# EAGLE design spdif (EAGLE 5.06)
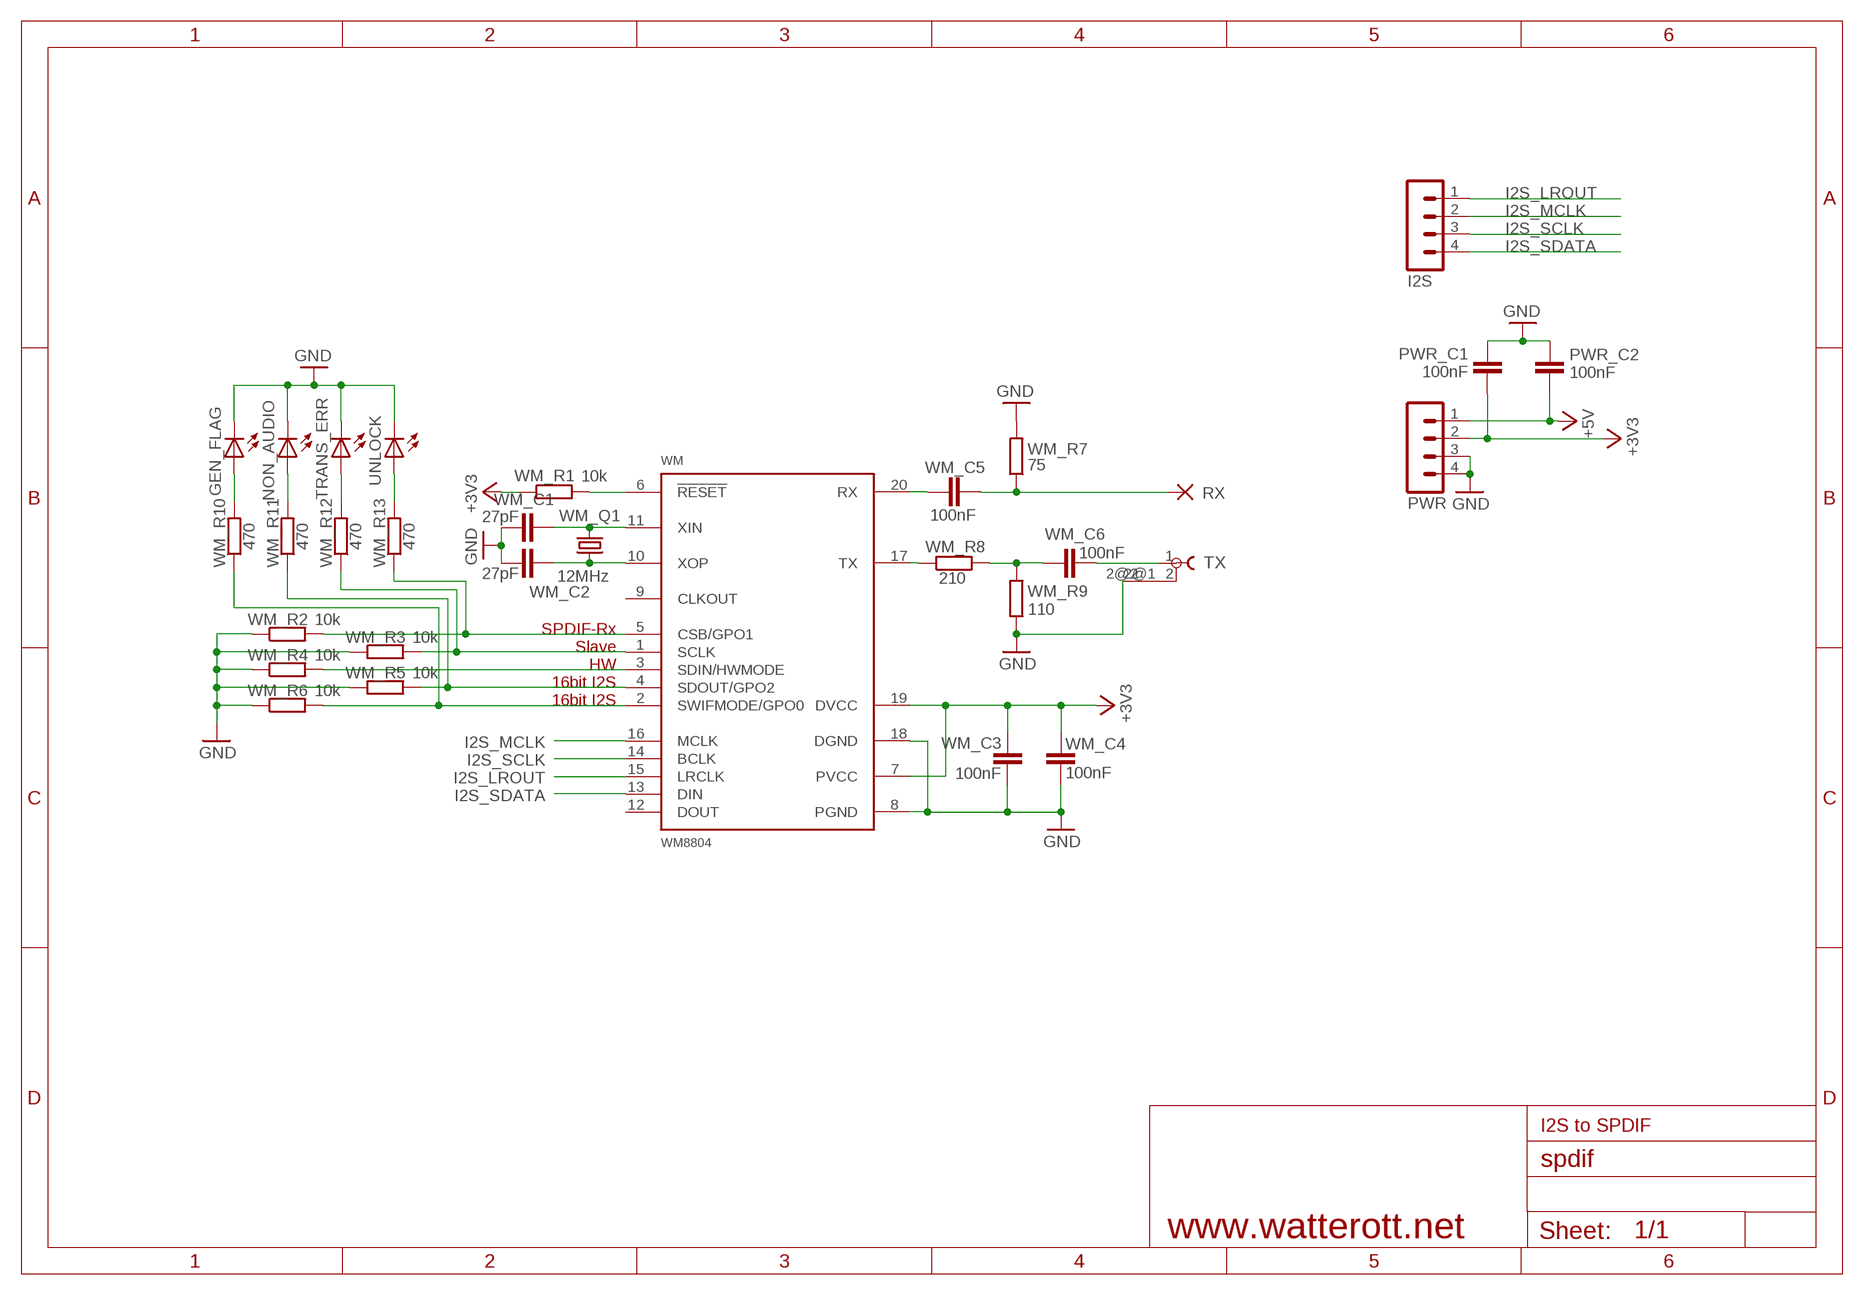
[diagram p0: schematic, sheet 1]

## Parts
GEN_FLAG  LEDCHIPLED_0805  [CHIPLED_0805]
I2S  MA04-1  [MA04-1]
NON_AUDIO  LEDCHIPLED_0805  [CHIPLED_0805]
PWR  MA04-1  [MA04-1]
PWR_C1  100nF  C-EUC0603  [C0603]
PWR_C2  100nF  C-EUC0603  [C0603]
RX  WIREPAD1,6/0,8  [1,6/0,8]
TRANS_ERR  LEDCHIPLED_0805  [CHIPLED_0805]
TX  TOBU3  [TOBU3]
UNLOCK  LEDCHIPLED_0805  [CHIPLED_0805]
WM  WM8804  [TSSOP20]
WM_C1  27pF  C-EUC0603  [C0603]
WM_C2  27pF  C-EUC0603  [C0603]
WM_C3  100nF  C-EUC0603  [C0603]
WM_C4  100nF  C-EUC0603  [C0603]
WM_C5  100nF  C-EUC0603  [C0603]
WM_C6  100nF  C-EUC0603  [C0603]
WM_Q1  12MHz  HC49UP  [HC49UP]
WM_R1  10k  R-EU_R0603  [R0603]
WM_R2  10k  R-EU_R0603  [R0603]
WM_R3  10k  R-EU_R0603  [R0603]
WM_R4  10k  R-EU_R0603  [R0603]
WM_R5  10k  R-EU_R0603  [R0603]
WM_R6  10k  R-EU_R0603  [R0603]
WM_R7  75  R-EU_R0603  [R0603]
WM_R8  210  R-EU_R0603  [R0603]
WM_R9  110  R-EU_R0603  [R0603]
WM_R10  470  R-EU_R0603  [R0603]
WM_R11  470  R-EU_R0603  [R0603]
WM_R12  470  R-EU_R0603  [R0603]
WM_R13  470  R-EU_R0603  [R0603]

## Nets
+3V3: PWR.2 PWR_C1.2 WM.7(PVCC) WM.19(DVCC) WM_C3.1 WM_C4.1 WM_R1.1
+5V: PWR.1 PWR_C2.2
CSB: WM.5(CSB/GPO1) WM_R2.2 WM_R13.1
GEN_FLAG: GEN_FLAG.A WM_R10.2
GND: GEN_FLAG.C NON_AUDIO.C PWR.3 PWR.4 PWR_C1.1 PWR_C2.1 TRANS_ERR.C TX.2@2 UNLOCK.C WM.8(PGND) WM.18(DGND) WM_C1.2 WM_C2.2 WM_C3.2 WM_C4.2 WM_R2.1 WM_R3.1 WM_R4.1 WM_R5.1 WM_R6.1 WM_R7.2 WM_R9.1
I2S_LROUT: I2S.1 WM.15(LRCLK)
I2S_MCLK: I2S.2 WM.16(MCLK)
I2S_SCLK: I2S.3 WM.14(BCLK)
I2S_SDATA: I2S.4 WM.13(DIN)
NON_AUDIO: NON_AUDIO.A WM_R11.2
RESET: WM.6(!RESET) WM_R1.2
RX0: WM.20(RX) WM_C5.2
RX1: RX.1(P) WM_C5.1 WM_R7.1
SCLK: WM.1(SCLK) WM_R3.2 WM_R12.1
SDIN: WM.3(SDIN/HWMODE) WM_R4.2
SDOUT: WM.4(SDOUT/GPO2) WM_R5.2 WM_R11.1
SWIFMODE: WM.2(SWIFMODE/GPO0) WM_R6.2 WM_R10.1
TRANS_ERR: TRANS_ERR.A WM_R12.2
TX0: WM.17(TX) WM_R8.1
TX1: WM_C6.2 WM_R8.2 WM_R9.2
TX2: TX.1 WM_C6.1
UNLOCK: UNLOCK.A WM_R13.2
XIN: WM.11(XIN) WM_C1.1 WM_Q1.2
XOP: WM.10(XOP) WM_C2.1 WM_Q1.1
Unconnected: TX.2 TX.2@1 WM.9(CLKOUT) WM.12(DOUT)

## Notes on the sheet
- SPDIF-Rx
- Slave
- HW
- 16bit I2S
- 16bit I2S
- I2S to SPDIF
- www.watterott.net

## Library data of the parts
GEN_FLAG NON_AUDIO TRANS_ERR UNLOCK = led:LED: LED OSRAM: - CHIPLED LG R971, LG N971, LY N971, LG Q971, LY Q971, LO R971, LY R971 LH N974, LH R974 LS Q976, LO Q976, LY Q976 LO Q996 - Hyper CHIPLED LW Q18S LB Q993, LB Q99A, LB R99A - SideLED LS A670, LO A670, LY A670, LG A670, LP A670 LB A673, LV A673, LT A673, LW A673 LH A674 LY A675 LS A676, LA A676, LO A676, LY A676, LW A676 LS A679, LY A679, LG A679 - Hyper Micro SIDELED® LS Y876, LA Y876, LO Y876, LY Y876 LT Y87S - SmartLED LW L88C, LW L88S LB L89C, LB L89S, LG L890 LS L89K, LO L89K, LY L89K LS L896, LA L896, LO L896, LY L896 - TOPLED LS T670, LO T670, LY T670, LG T670, LP T670 LSG T670, LSP T670, LSY T670, LOP T670, LYG T670 LG T671, LOG T671, LSG T671 LB T673, LV T673, LT T673, LW T673 LH T674 LS T676, LA T676, LO T676, LY T676, LB T676, LH T676, LSB T676, LW T676 LB T67C, LV T67C, LT T67C, LS T67K, LO T67K, LY T67K, LW E67C LS E67B, LA E67B, LO E67B, LY E67B, LB E67C, LV E67C, LT E67C LW T67C LS T679, LY T679, LG T679 LS T770, LO T770, LY T770, LG T770, LP T770 LB T773, LV T773, LT T773, LW T773 LH T774 LS E675, LA E675, LY E675, LS T675 LS T776, LA T776, LO T776, LY T776, LB T776 LHGB T686 LT T68C, LB T68C - Hyper Mini TOPLED® LB M676 - Mini TOPLED Santana® LG M470 LS M47K, LO M47K, LY M47K Source: http://www.osram.convergy.de LUXEON: - LUMILED® LXK2-PW12-R00, LXK2-PW12-S00, LXK2-PW14-U00, LXK2-PW14-V00 LXK2-PM12-R00, LXK2-PM12-S00, LXK2-PM14-U00 LXK2-PE12-Q00, LXK2-PE12-R00, LXK2-PE12-S00, LXK2-PE14-T00, LXK2-PE14-U00 LXK2-PB12-K00, LXK2-PB12-L00, LXK2-PB12-M00, LXK2-PB14-N00, LXK2-PB14-P00, LXK2-PB14-Q00 LXK2-PR12-L00, LXK2-PR12-M00, LXK2-PR14-Q00, LXK2-PR14-R00 LXK2-PD12-Q00, LXK2-PD12-R00, LXK2-PD12-S00 LXK2-PH12-R00, LXK2-PH12-S00 LXK2-PL12-P00, LXK2-PL12-Q00, LXK2-PL12-R00 Source: www.luxeon.com KINGBRIGHT: KA-3528ASYC Source: www.kingbright.com
I2S PWR = con-lstb:MA04-1: PIN HEADER
PWR_C1 PWR_C2 WM_C1-WM_C6 = rcl:C-EU: CAPACITOR, European symbol
RX = wirepad:WIREPAD: Wire PAD connect wire on PCB
TX = con-hirschmann:TOBU3: Female Cinch CONNECTOR ( RCA Jack )
WM = Audio:WM8804: Wolfson WM8804 Digital Interface Transceiver (SPDIF)
WM_Q1 = Crystal:HC49UP
WM_R1-WM_R13 = rcl:R-EU_: RESISTOR, European symbol

## Board
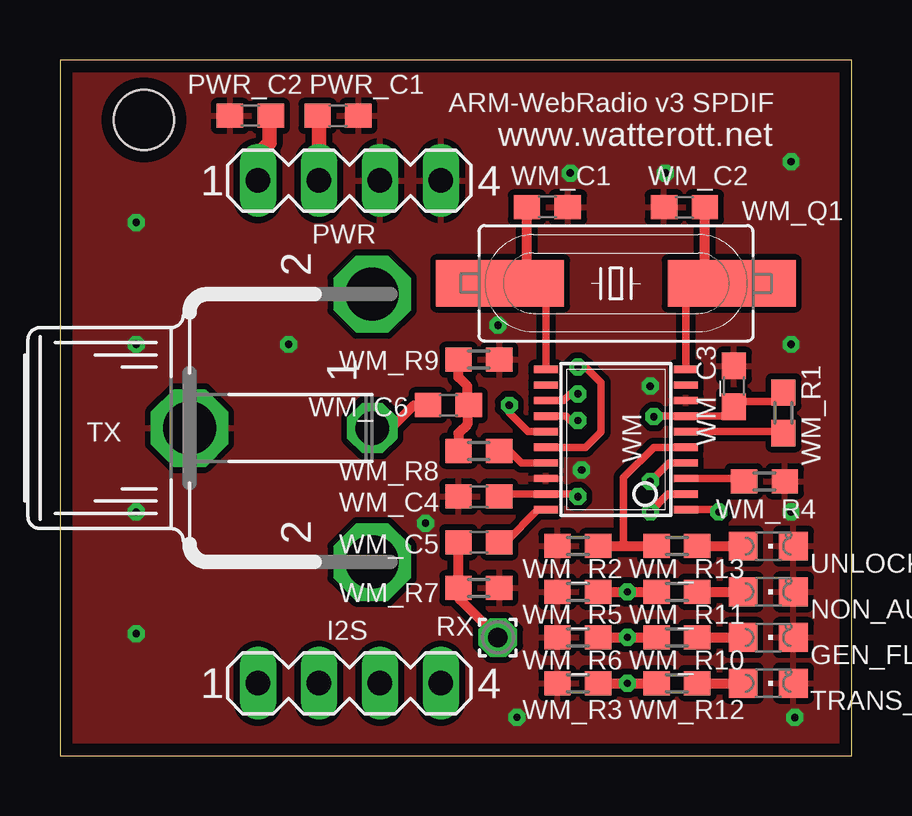
[diagram p1: board, top side]
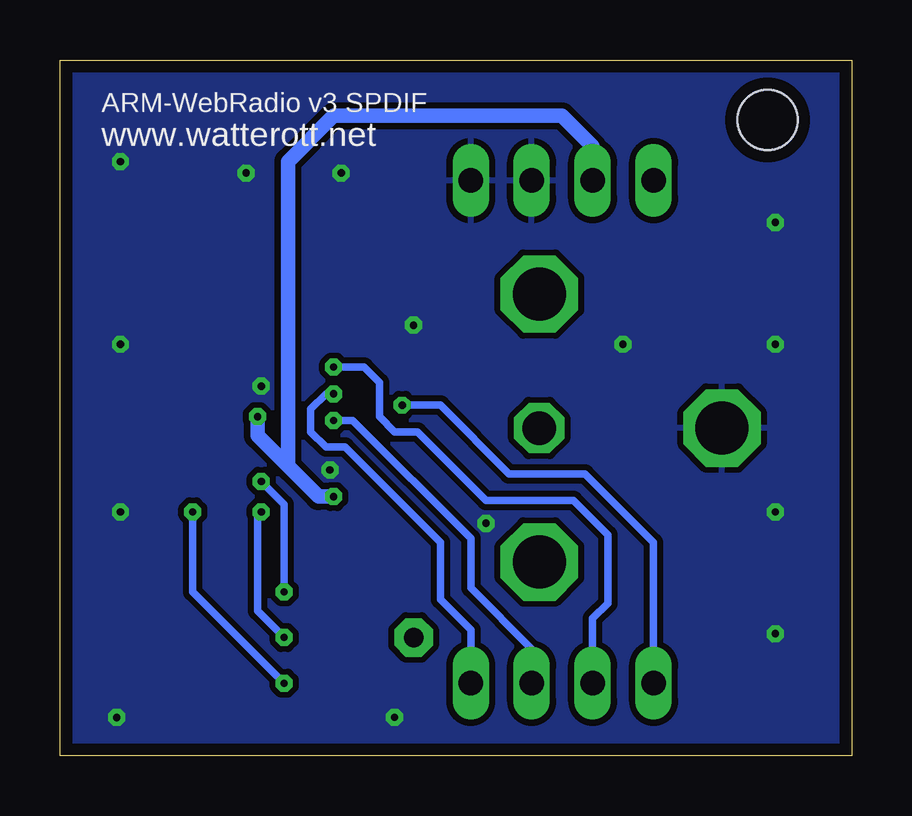
[diagram p2: board, bottom side, seen from below]

Size 33 x 29 mm. Coordinates in mm from the lower left corner, seen from the top.
Outline: 0,0 33,0 33,29 0,29 0,0
Copper layers (1*16): Top 0.035mm / dielectric 1.5mm / Bottom 0.035mm
Design rules "default *": minimum track width 7mil, minimum drill 0.3mm, track to track 7mil, track to pad 7mil, pad to pad 7mil, via to via 7mil, smd to smd 7mil, copper to edge 20mil, drill to drill 8mil, minimum pad ring 10mil, minimum via ring 8mil, stop-mask expansion 4mil, vias tented up to drill 0.5mm, thermal gap 10mil
Holes 2.5 mm at 3.5,26.5

### Footprints (pad centres in the part's own frame; a part is rotated, then mirrored left to right if it is on the bottom)
CHIPLED_0805 = smd 1.2 x 1.2: A 0,-1.05; C 0,1.05
MA04-1 = drill 1.016 long: 1 -3.81,0; 2 -1.27,0; 3 1.27,0; 4 3.81,0
C0603 = smd 1.1 x 1: 1 -0.85,0; 2 0.85,0
1,6/0,8 = drill 0.813 pad 1.6 octagon: 1 0,0
TOBU3 = drill 1.397 octagon: 1 0,-2.54 | drill 2.21 octagon: 2 5.588,-2.54; 2@1 -5.588,-2.54; 2@2 0,5.08
TSSOP20 = smd 0.305 x 0.991: 1 -2.925,-2.918; 2 -2.275,-2.918; 3 -1.625,-2.918; 4 -0.975,-2.918; 5 -0.325,-2.918; 6 0.325,-2.918; 7 0.975,-2.918; 8 1.625,-2.918; 9 2.275,-2.918; 10 2.925,-2.918; 11 2.925,2.918; 12 2.275,2.918; 13 1.625,2.918; 14 0.975,2.918; 15 0.325,2.918; 16 -0.325,2.918; 17 -0.975,2.918; 18 -1.625,2.918; 19 -2.275,2.918; 20 -2.925,2.918
HC49UP = smd 5.334 x 1.93: 1 -4.826,0; 2 4.826,0
R0603 = smd 1.1 x 1: 1 -0.85,0; 2 0.85,0

### Placement (x,y rotation side)
GEN_FLAG  29.53,4.92 270 top
I2S  12.06,3.02 0 top
NON_AUDIO  29.53,6.83 270 top
PWR  12.06,23.97 0 top
PWR_C1  11.59,26.67 180 top
PWR_C2  7.94,26.67 0 top
RX  18.26,4.92 90 top
TRANS_ERR  29.53,3.02 270 top
TX  10.48,13.65 90 top
UNLOCK  29.53,8.73 270 top
WM  23.18,13.18 90 top
WM_C1  20.32,22.86 0 top
WM_C2  26.04,22.86 180 top
WM_C3  28.1,15.4 90 top
WM_C4  17.46,10.79 180 top
WM_C5  17.46,8.89 0 top
WM_C6  16.19,14.61 0 top
WM_Q1  23.18,19.69 180 top
WM_R1  30.16,14.29 270 top
WM_R2  21.59,8.73 0 top
WM_R3  21.59,3.02 0 top
WM_R4  29.37,11.43 180 top
WM_R5  21.59,6.83 0 top
WM_R6  21.59,4.92 0 top
WM_R7  17.46,6.98 0 top
WM_R8  17.46,12.7 180 top
WM_R9  17.46,16.51 180 top
WM_R10  25.72,4.92 0 top
WM_R11  25.72,6.83 0 top
WM_R12  25.72,3.02 0 top
WM_R13  25.72,8.73 0 top

### Tracks (layer width: path | path; a pad name or v marks a point on that pad's centre or on a via)
+3V3  (via drill 0.3)
  Top 0.305: WM_R1.1 30.16,15.08 29.84,14.76 28.31,14.76 WM_C3.1 27.7,14.15 WM.7 24.79,14.15 v24.77,14.13 | WM_C4.1 18.42,10.9 WM.19 21.48,10.9 v21.59,10.79
  Top 0.61: PWR.2 10.79,26.61 PWR_C1.2
  Bottom 0.406: 23.42,11.99 23.5,12.06
  Bottom 0.61: PWR.2 10.79,25.4 12.06,26.67 21.59,26.67 23.5,24.77 23.5,12.06 | v21.59,10.79 22.23,10.79 23.42,11.99 24.77,13.34 v24.77,14.13
+5V
  Top 0.61: PWR.1 8.26,25.08 8.73,25.56 8.73,26.61 PWR_C2.2
CSB
  Top 0.305: WM.5 24.76,12.85 23.5,11.59 23.5,8.73
  Top 0.406: WM_R2.2 23.5,8.73 WM_R13.1
GEN_FLAG
  Top 0.406: WM_R10.2 GEN_FLAG.A
GND  (via drill 0.3)
  other vias: 19.05,1.59 30.64,1.59 24.61,15.4 30.48,17.15 25.24,24.29 21.75,11.91 21.27,24.29 18.26,17.94 30.48,10.16 15.24,9.68 3.18,10.16 3.18,5.08 3.18,17.15 3.18,22.23 9.53,17.15 30.48,24.77
  pour Top (isolate 0.254, rank 2): 0.5,28.5 32.5,28.5 32.5,0.5 0.5,0.5
  pour Bottom (isolate 0.254, rank 2): 0.5,28.5 32.5,28.5 32.5,0.5 0.5,0.5
I2S_LROUT  (via drill 0.3)
  Top 0.305: WM.15 19.52,13.5 18.73,14.29 v18.73,14.61 | v18.73,14.61
  Bottom 0.305: I2S.1 8.26,8.89 11.11,11.75 | v18.73,14.61 17.14,14.61 14.29,11.75 11.11,11.75 | 11.11,11.75
I2S_MCLK  (via drill 0.3)
  Top 0.305: WM.16 21.9,12.85 22.54,13.49 22.54,15.56 21.91,16.19 v21.59,16.19
  Bottom 0.305: I2S.2 10.79,5.71 10.16,6.35 10.16,9.21 11.59,10.64 15.24,10.64 18.1,13.49 19.05,13.49 19.68,14.13 19.68,15.56 20.32,16.19 v21.59,16.19
I2S_SCLK  (via drill 0.3)
  Top 0.305: WM.14 21.09,14.15 21.27,13.97 v21.59,13.97
  Bottom 0.305: I2S.3 13.34,4.45 15.88,6.99 15.88,9.05 20.8,13.97 v21.59,13.97
I2S_SDATA  (via drill 0.3)
  Top 0.305: WM.13 20.99,14.8 21.27,15.08 v21.59,15.08
  Bottom 0.305: I2S.4 15.88,5.24 17.14,6.51 17.14,8.89 21.11,12.86 21.91,12.86 22.54,13.49 22.54,14.45 21.91,15.08 v21.59,15.08
NON_AUDIO
  Top 0.406: WM_R11.2 NON_AUDIO.A
RESET
  Top 0.305: WM.6 30.1,13.5 WM_R1.2
RX0
  Top 0.305: WM.20 19.93,10.25 18.57,8.89 WM_C5.2 | WM_C5.2
RX1
  Top 0.305: 16.67,6.93 WM_R7.1
  Top 0.406: WM_R7.1 WM_C5.1 | RX.1 16.67,6.51 16.67,6.93
SCLK  (via drill 0.3)
  Top 0.305: WM.1 27.37,10.25 v27.46,10.16
  Top 0.406: WM_R3.2 v23.65,3.02 WM_R12.1
  Bottom 0.305: v23.65,3.02 | v23.65,3.02 27.46,6.83 v27.46,10.16 | v27.46,10.16
SDIN
  Top 0.305: WM.3 28.4,11.55 WM_R4.2
SDOUT  (via drill 0.3)
  Top 0.305: WM.4 25.38,12.2 v24.61,11.43
  Top 0.406: WM_R5.2 v23.65,6.83 WM_R11.1
  Bottom 0.305: v23.65,6.83 23.65,10.48 v24.61,11.43
SWIFMODE  (via drill 0.3)
  Top 0.305: WM.2 25.35,10.9 v24.61,10.16
  Top 0.406: WM_R6.2 v23.65,4.92 WM_R10.1
  Bottom 0.305: v23.65,4.92 | v23.65,4.92 24.77,6.03 24.77,10 v24.61,10.16
TRANS_ERR
  Top 0.406: WM_R12.2 TRANS_ERR.A
TX0
  Top 0.305: WM.17 19.23,12.2 18.73,12.7 WM_R8.1
TX1
  Top 0.305: 16.99,14.66 WM_C6.2 16.99,14.55
  Top 0.406: WM_R9.2 16.61,15.77 16.99,15.4 16.99,14.66 | WM_R8.2 16.61,13.44 16.99,13.81 16.99,14.55
TX2
  Top 0.305: WM_C6.1
  Top 0.406: TX.1 13.81,13.65 14.76,14.61 WM_C6.1
UNLOCK
  Top 0.406: WM_R13.2 UNLOCK.A
XIN
  Top 0.305: WM.11 20.26,19.68 WM_Q1.2 19.47,19.68
  Top 0.406: 19.47,19.68 WM_C1.1
XOP
  Top 0.305: WM.10 26.09,19.68 WM_Q1.1 26.89,19.68
  Top 0.406: 26.89,19.68 WM_C2.1

### Text on the board
tPlace: ARM-WebRadio v3 SPDIF | www.watterott.net
bPlace: ARM-WebRadio v3 SPDIF | www.watterott.net